# Altium schematic sheet 传感器,通信模块电路.SchDoc
size A4
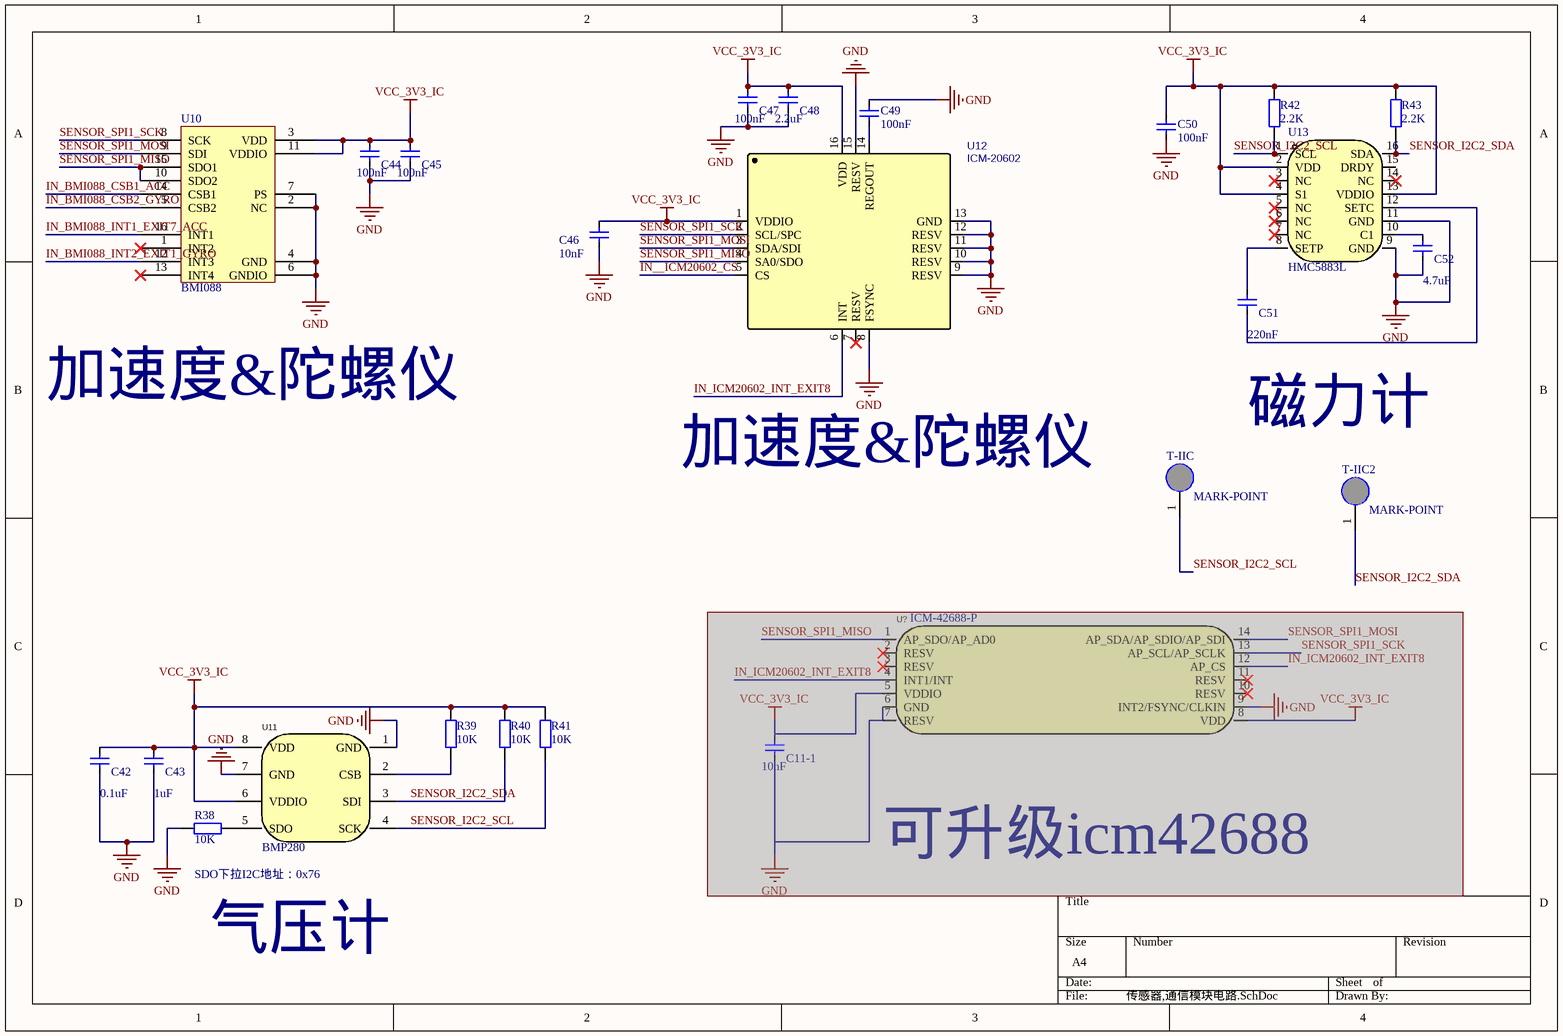
[diagram p0: 传感器,通信模块电路.SchDoc]

## Parts
C11-1  10nF  [0603_C]  (masked out: inside a compile mask, not in the netlist)
C42  0.1uF  [0603_C]
C43  1uF  [0603_C]
C44  100nF  [0603_C]
C45  100nF  [0603_C]
C46  10nF  [0603_C]
C47  100nF  [0603_C]
C48  2.2uF  [0603_C]
C49  100nF  [0603_C]
C50  100nF  [0603_C]
C51  220nF  [0603_C]
C52  4.7uF  [0603_C]
R38  10K  [0603_R]
R39  10K  [0603_R]
R40  10K  [0603_R]
R41  10K  [0603_R]
R42  2.2K  [0603_R]
R43  2.2K  [0603_R]
T-IIC  MARK-POINT  [MARK-POINT]
T-IIC2  MARK-POINT  [MARK-POINT]
U10  BMI088  [LGA-16_L4.5-W3.0-P0.50-BL]
U11  BMP280  [BMP280]
U12  ICM-20602  [ICM20602]
U13  HMC5883L  [HMC5883L]
U?  ICM-42688-P  [LGA-14_L3.0-W2.5-P0.50-TL]  (masked out: inside a compile mask, not in the netlist)

## Nets
GND: C42.2 C43.2 C44.2 C45.2 C46.2 C47.2 C48.2 C49.2 C50.1 C52.2 R38.1 U10.2(NC) U10.4(GND) U10.6(GNDIO) U10.7(PS) U11.1(GND) U11.7(GND) U12.8(FSYNC) U12.9(RESV) U12.10(RESV) U12.11(RESV) U12.12(RESV) U12.13(GND) U12.15(RESV) U13.9(GND) U13.11(GND)
VCC_3V3_IC: C42.1 C43.1 C44.1 C45.1 C46.1 C47.1 C48.1 C50.2 R39.1 R40.1 R41.1 R42.1 R43.1 U10.3(VDD) U10.11(VDDIO) U11.6(VDDIO) U11.8(VDD) U12.1(VDDIO) U12.16(VDD) U13.2(VDD) U13.4(S1) U13.13(VDDIO)
IN__ICM20602_CS: U12.5(CS)
IN_BMI088_CSB1_ACC: U10.14(CSB1)
IN_BMI088_CSB2_GYRO: U10.5(CSB2)
IN_BMI088_INT1_EXIT7_ACC: U10.16(INT1)
IN_BMI088_INT2_EXIT1_GYRO: U10.12(INT3)
IN_ICM20602_INT_EXIT8: U12.6(INT)
SENSOR_I2C2_SCL: R41.2 R42.2 T-IIC.1 U11.4(SCK) U13.1(SCL)
SENSOR_I2C2_SDA: R40.2 R43.2 T-IIC2.1 U11.3(SDI) U13.16(SDA)
SENSOR_SPI1_MISO: U10.10(SDO2) U10.15(SDO1) U12.4(SA0/SDO)
SENSOR_SPI1_MOSI: U10.9(SDI) U12.3(SDA/SDI)
SENSOR_SPI1_SCK: U10.8(SCK) U12.2(SCL/SPC)
NetC49_1: C49.1 U12.14(REGOUT)
NetC51_1: C51.1 U13.8(SETP)
NetC51_2: C51.2 U13.12(SETC)
NetC52_1: C52.1 U13.10(C1)
NetR38_2: R38.2 U11.5(SDO)
NetR39_2: R39.2 U11.2(CSB)

Not connected (* = marked no-connect by the designer): U10 1(INT2)* 13(INT4)*; U12 7(RESV)*; U13 3(NC)* 5(NC)* 6(NC)* 7(NC)* 14(NC)* 15(DRDY)

## Notes on the sheet
- 加速度&陀螺仪
- 磁力计
- SDO下拉I2C地址：0x76
- 可升级icm42688
- 气压计

## Library data of the parts
C11-1 C42-C52 = CAP1
R38-R43 = RES: Ressitor; Value: 1K
U11 = BMP280: Manufacturer: Bosch(博世); Add into BOM: yes; Name: BMP280; Symbol: BMP280; Device: BMP280; LCSC Part Name: BMP280; Supplier Part: C83291; Manufacturer Part: BMP280; Supplier Footprint: LGA-8(2x2.5); JLCPCB Part Class: Extended Part; Datasheet: https://atta.szlcsc.com/upload/public/pdf/source/20200702/C83291_F39E84AB7DFC569A4C7554F8659640A1.pdf; Supplier: LCSC; Convert to PCB: yes
U12 = ICM-20602: BOM_Manufacturer: TDK InvenSense; Contributor: LCSC; SMT Type: Extend; BOM_Supplier: LCSC; BOM_Supplier Part: C97633; BOM_Manufacturer Part: ICM-20602; BOM_LCSC Assembly: Yes; spicePre: U; spiceSymbolName: ICM-20602
U13 = HMC5883L: Add into BOM: yes; Symbol: HMC5883L; Device: HMC5883L; LCSC Part Name: HMC5883L; Supplier Part: C2859540; Manufacturer Part: HMC5883L; Supplier Footprint: LPCC-16_L3.0-W3.0-P0.50; JLCPCB Part Class: 扩展库; Datasheet: 2021-07-28/72509S/c1235ff140a5464880e3b48633b24d5e/HMC5883L中文.pdf; Supplier: LCSC; Convert to PCB: yes; Name: HMC5883L
U? = ICM-42688-P: Manufacturer: TDK InvenSense(应美盛); Add into BOM: yes; Name: ICM-42688-P; Symbol: ICM-42688-P; Device: ICM-42688-P; LCSC Part Name: ICM 42688 P; Supplier Part: C1850418; Manufacturer Part: ICM-42688-P; Supplier Footprint: LGA-14(2.5x3); JLCPCB Part Class: Extended Part; Datasheet: https://atta.szlcsc.com/upload/public/pdf/source/20210703/CF24204867ACE5B754A2B035F23E5931.pdf; Supplier: LCSC; Convert to PCB: yes